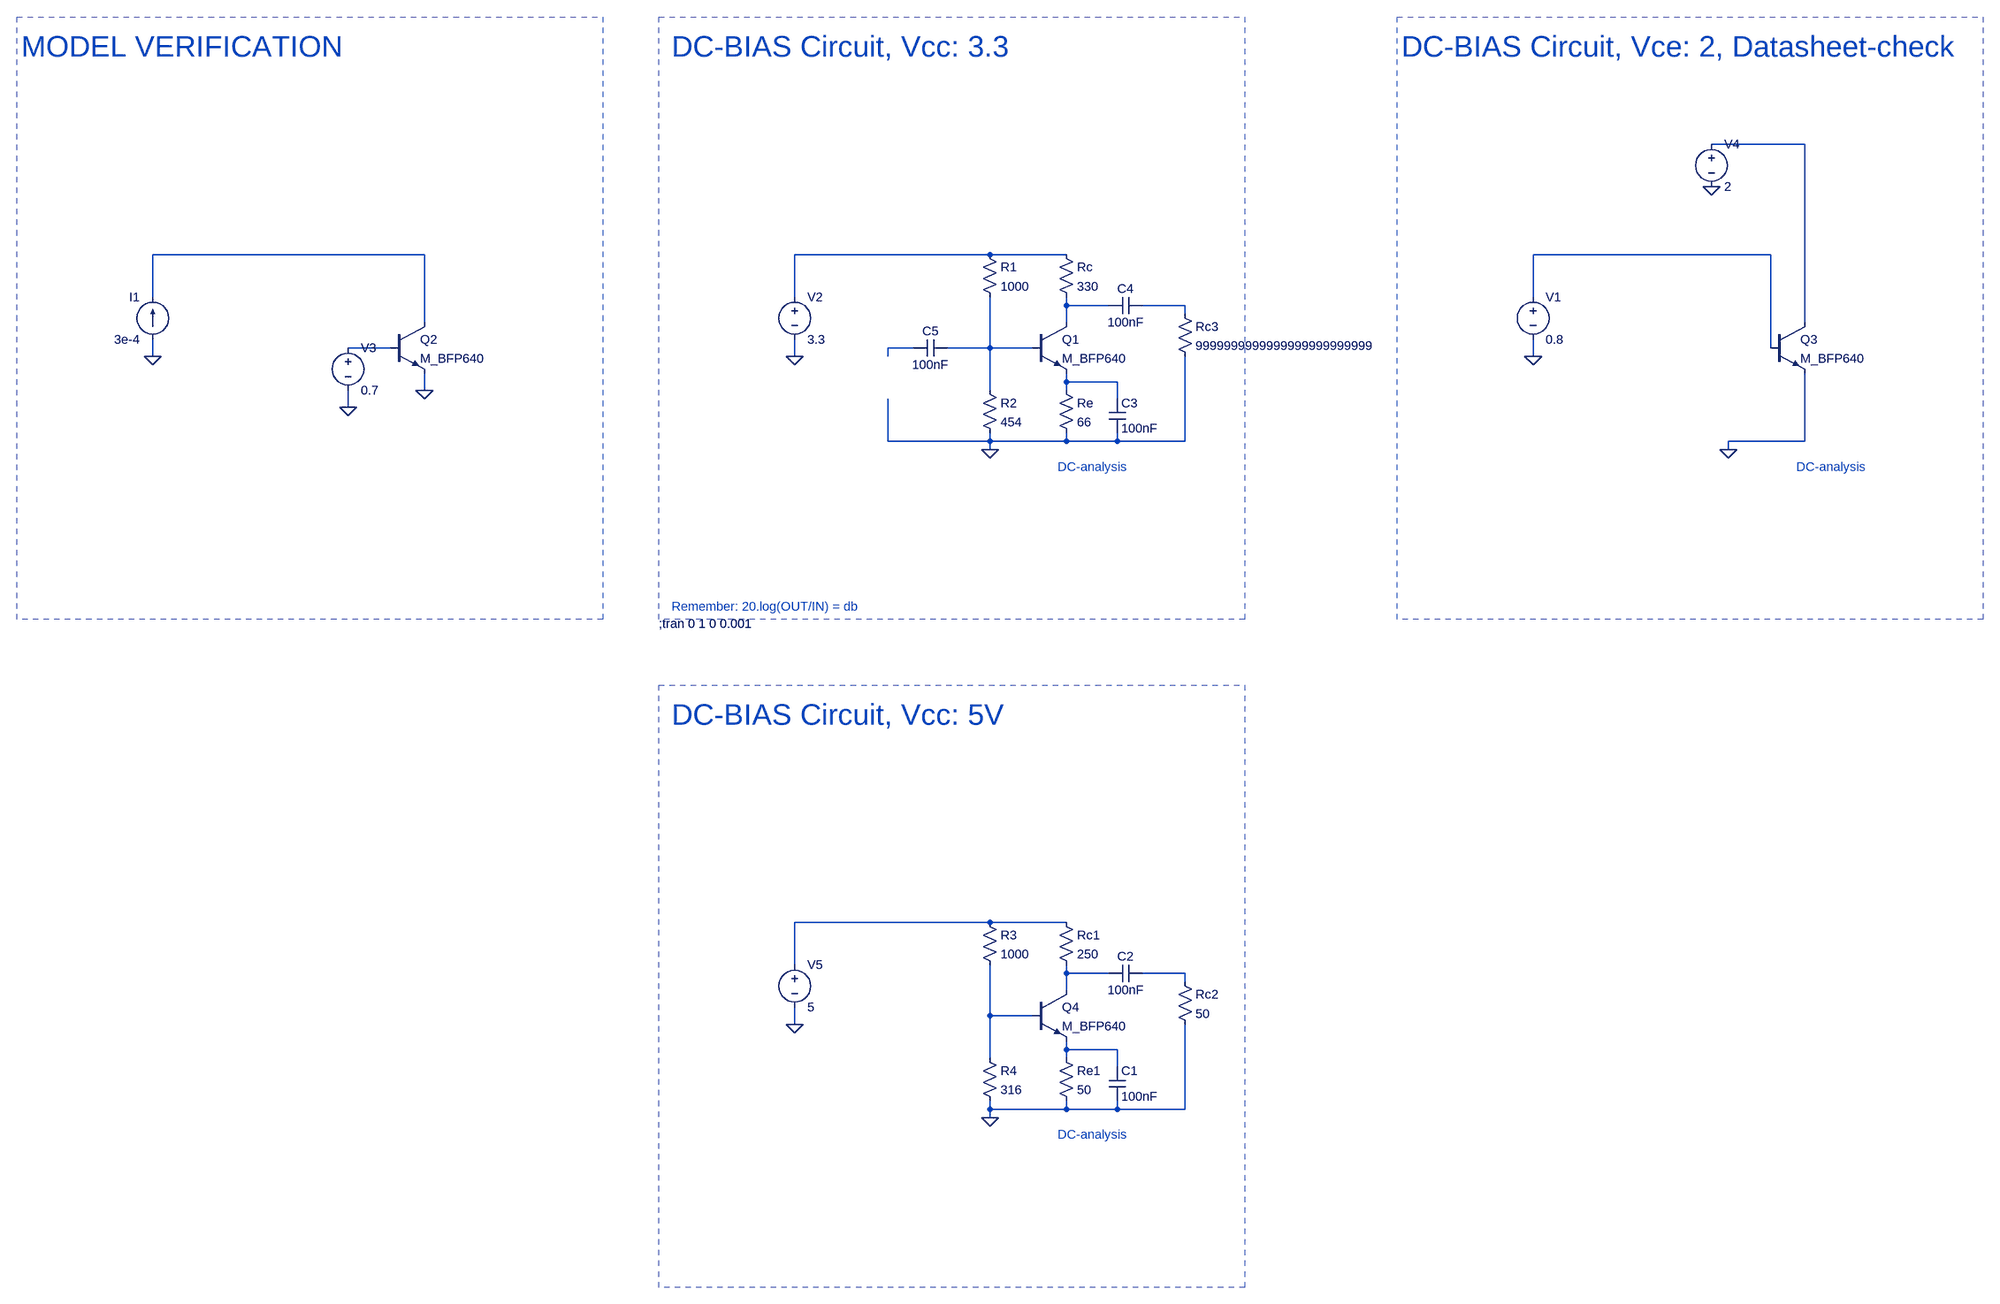
[diagram p0: schematic LNA_BASICS.asc]
LNA_BASICS.asc, the LTspice schematic file:
Version 4
SHEET 1 1784 2072
WIRE 1440 -256 1264 -256
WIRE -1312 -48 -1824 -48
WIRE -96 -48 -464 -48
WIRE 48 -48 -96 -48
WIRE 1376 -48 928 -48
WIRE -1824 32 -1824 -48
WIRE -464 32 -464 -48
WIRE 928 32 928 -48
WIRE 48 48 48 32
WIRE 128 48 48 48
WIRE 272 48 192 48
WIRE 272 64 272 48
WIRE -1312 80 -1312 -48
WIRE 48 80 48 48
WIRE 1440 80 1440 -256
WIRE -1376 128 -1456 128
WIRE -240 128 -288 128
WIRE -96 128 -96 32
WIRE -96 128 -176 128
WIRE -16 128 -96 128
WIRE 1376 128 1376 -48
WIRE -1824 144 -1824 112
WIRE -464 144 -464 112
WIRE -288 144 -288 128
WIRE 928 144 928 112
WIRE 48 192 48 176
WIRE 144 192 48 192
WIRE -1312 208 -1312 176
WIRE -96 208 -96 128
WIRE 48 208 48 192
WIRE 144 224 144 192
WIRE -1456 240 -1456 208
WIRE -288 304 -288 224
WIRE -96 304 -96 288
WIRE -96 304 -288 304
WIRE 48 304 48 288
WIRE 48 304 -96 304
WIRE 144 304 144 288
WIRE 144 304 48 304
WIRE 272 304 272 144
WIRE 272 304 144 304
WIRE 1440 304 1440 176
WIRE 1440 304 1296 304
WIRE -96 320 -96 304
WIRE 1296 320 1296 304
WIRE -96 1360 -464 1360
WIRE 48 1360 -96 1360
WIRE -464 1440 -464 1360
WIRE 48 1456 48 1440
WIRE 128 1456 48 1456
WIRE 272 1456 192 1456
WIRE 272 1472 272 1456
WIRE 48 1488 48 1456
WIRE -96 1536 -96 1440
WIRE -16 1536 -96 1536
WIRE -464 1552 -464 1520
WIRE 48 1600 48 1584
WIRE 144 1600 48 1600
WIRE -96 1616 -96 1536
WIRE 48 1616 48 1600
WIRE 144 1632 144 1600
WIRE -96 1712 -96 1696
WIRE 48 1712 48 1696
WIRE 48 1712 -96 1712
WIRE 144 1712 144 1696
WIRE 144 1712 48 1712
WIRE 272 1712 272 1552
WIRE 272 1712 144 1712
WIRE -96 1728 -96 1712
FLAG -464 144 0
FLAG -96 320 0
FLAG -1824 144 0
FLAG -1456 240 0
FLAG -1312 208 0
FLAG 928 144 0
FLAG 1296 320 0
FLAG 1264 -176 0
FLAG -464 1552 0
FLAG -96 1728 0
DATAFLAG 48 64 ""
DATAFLAG 48 192 ""
DATAFLAG -32 128 "$-V(N009)"
DATAFLAG -128 128 ""
DATAFLAG -144 128 ""
DATAFLAG -144 128 ""
DATAFLAG -144 128 ""
SYMBOL voltage -464 16 R0
WINDOW 123 0 0 Left 0
WINDOW 39 0 0 Left 0
SYMATTR InstName V2
SYMATTR Value 3.3
SYMBOL npn -16 80 R0
SYMATTR InstName Q1
SYMATTR Value M_BFP640
SYMBOL res -112 -64 R0
SYMATTR InstName R1
SYMATTR Value 1000
SYMBOL res -112 192 R0
SYMATTR InstName R2
SYMATTR Value 454
SYMBOL res 32 192 R0
SYMATTR InstName Re
SYMATTR Value 66
SYMBOL res 32 -64 R0
SYMATTR InstName Rc
SYMATTR Value 330
SYMBOL npn -1376 80 R0
SYMATTR InstName Q2
SYMATTR Value M_BFP640
SYMBOL voltage -1456 112 R0
WINDOW 123 0 0 Left 0
WINDOW 39 0 0 Left 0
SYMATTR InstName V3
SYMATTR Value 0.7
SYMBOL current -1824 112 R180
WINDOW 0 24 80 Left 2
WINDOW 3 24 0 Left 2
WINDOW 123 0 0 Left 0
WINDOW 39 0 0 Left 0
SYMATTR InstName I1
SYMATTR Value 3e-4
SYMBOL voltage 928 16 R0
WINDOW 123 0 0 Left 0
WINDOW 39 0 0 Left 0
SYMATTR InstName V1
SYMATTR Value 0.8
SYMBOL npn 1376 80 R0
SYMATTR InstName Q3
SYMATTR Value M_BFP640
SYMBOL voltage 1264 -272 R0
WINDOW 123 0 0 Left 0
WINDOW 39 0 0 Left 0
SYMATTR InstName V4
SYMATTR Value 2
SYMBOL voltage -464 1424 R0
WINDOW 123 0 0 Left 0
WINDOW 39 0 0 Left 0
SYMATTR InstName V5
SYMATTR Value 5
SYMBOL npn -16 1488 R0
SYMATTR InstName Q4
SYMATTR Value M_BFP640
SYMBOL res -112 1344 R0
SYMATTR InstName R3
SYMATTR Value 1000
SYMBOL res -112 1600 R0
SYMATTR InstName R4
SYMATTR Value 316
SYMBOL res 32 1600 R0
SYMATTR InstName Re1
SYMATTR Value 50
SYMBOL res 32 1344 R0
SYMATTR InstName Rc1
SYMATTR Value 250
SYMBOL res 256 1456 R0
SYMATTR InstName Rc2
SYMATTR Value 50
SYMBOL cap 128 1632 R0
SYMATTR InstName C1
SYMATTR Value 100nF
SYMBOL cap 192 1440 R90
WINDOW 0 0 32 VBottom 2
WINDOW 3 32 32 VTop 2
SYMATTR InstName C2
SYMATTR Value 100nF
SYMBOL res 256 48 R0
SYMATTR InstName Rc3
SYMATTR Value 9999999999999999999999999
SYMBOL cap 128 224 R0
SYMATTR InstName C3
SYMATTR Value 100nF
SYMBOL cap 192 32 R90
WINDOW 0 0 32 VBottom 2
WINDOW 3 32 32 VTop 2
SYMATTR InstName C4
SYMATTR Value 100nF
SYMBOL cap -176 112 R90
WINDOW 0 0 32 VBottom 2
WINDOW 3 32 32 VTop 2
SYMATTR InstName C5
SYMATTR Value 100nF
TEXT 32 352 Left 2 ;DC-analysis
TEXT -720 648 Left 2 !;tran 0 1 0 0.001
TEXT -2072 -440 Left 5 ;MODEL VERIFICATION
TEXT -696 -440 Left 5 ;DC-BIAS Circuit, Vcc: 3.3
TEXT 1424 352 Left 2 ;DC-analysis
TEXT 680 -440 Left 5 ;DC-BIAS Circuit, Vce: 2, Datasheet-check
TEXT 32 1760 Left 2 ;DC-analysis
TEXT -696 968 Left 5 ;DC-BIAS Circuit, Vcc: 5V
TEXT -696 616 Left 2 ;Remember: 20.log(OUT/IN) = db
RECTANGLE Normal 384 640 -720 -496 2
RECTANGLE Normal -976 640 -2080 -496 2
RECTANGLE Normal 1776 640 672 -496 2
RECTANGLE Normal 384 2048 -720 912 2

The netlist it stands for:
* LNA_BASICS.asc
V2 N003 0 3.3
Q1 N005 N009 N010 0 M_BFP640
R1 N003 N009 1000
R2 N009 0 454
Re N010 0 66
Rc N003 N005 330
Q2 N002 N007 0 0 M_BFP640
V3 N007 0 0.7
I1 0 N002 3e-4
V1 N004 0 0.8
Q3 N001 N004 0 0 M_BFP640
V4 N001 0 2
V5 N011 0 5
Q4 N012 N014 N015 0 M_BFP640
R3 N011 N014 1000
R4 N014 0 316
Re1 N015 0 50
Rc1 N011 N012 250
Rc2 N013 0 50
C1 N015 0 100nF
C2 N013 N012 100nF
Rc3 N006 0 9999999999999999999999999
C3 N010 0 100nF
C4 N006 N005 100nF
C5 N009 N008 100nF
.model NPN NPN
.model PNP PNP
.lib standard.bjt
* DC-analysis
;tran 0 1 0 0.001
* MODEL VERIFICATION
* DC-BIAS Circuit, Vcc: 3.3
* DC-analysis
* DC-BIAS Circuit, Vce: 2, Datasheet-check
* DC-analysis
* DC-BIAS Circuit, Vcc: 5V
* Remember: 20.log(OUT/IN) = db
.backanno
.end